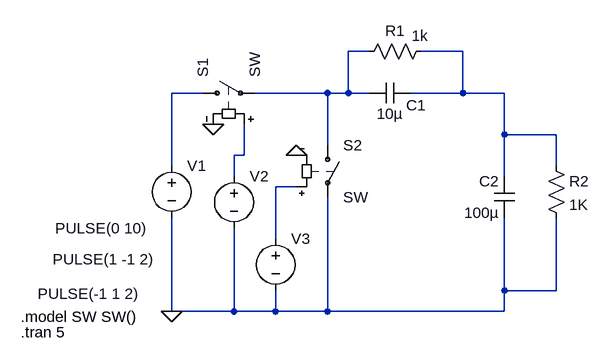
[diagram p0: schematic CA lab 1[1202].asc]
CA lab 1[1202].asc, the LTspice schematic file:
Version 4
SHEET 1 880 680
WIRE 272 -32 240 -32
WIRE 416 -32 352 -32
WIRE 16 32 -32 32
WIRE 208 32 96 32
WIRE 240 32 240 -32
WIRE 240 32 208 32
WIRE 272 32 240 32
WIRE 416 32 416 -32
WIRE 416 32 336 32
WIRE 480 32 416 32
WIRE 480 96 480 32
WIRE 560 96 480 96
WIRE 208 112 208 32
WIRE 80 128 80 80
WIRE 80 128 64 128
WIRE -32 144 -32 32
WIRE 560 144 560 96
WIRE 64 160 64 128
WIRE 480 160 480 96
WIRE 160 176 128 176
WIRE 128 256 128 176
WIRE 480 336 480 224
WIRE 560 336 560 224
WIRE 560 336 480 336
WIRE -32 368 -32 224
WIRE 64 368 64 240
WIRE 64 368 -32 368
WIRE 128 368 128 336
WIRE 128 368 64 368
WIRE 208 368 208 192
WIRE 208 368 128 368
WIRE 480 368 480 336
WIRE 480 368 208 368
FLAG -32 368 0
FLAG 160 128 0
FLAG 32 80 0
SYMBOL voltage -32 128 R0
WINDOW 3 -179 112 Left 2
WINDOW 123 0 0 Left 2
WINDOW 39 0 0 Left 2
SYMATTR Value PULSE(0 10)
SYMATTR InstName V1
SYMBOL cap 336 16 R90
WINDOW 0 50 -8 VBottom 2
WINDOW 3 32 32 VTop 2
SYMATTR InstName C1
SYMATTR Value 10µ
SYMBOL cap 496 224 R180
WINDOW 0 24 56 Left 2
WINDOW 3 24 8 Left 2
SYMATTR InstName C2
SYMATTR Value 100µ
SYMBOL res 256 -16 R270
WINDOW 0 32 56 VTop 2
WINDOW 3 56 94 VBottom 2
SYMATTR InstName R1
SYMATTR Value 1k
SYMBOL res 544 128 R0
SYMATTR InstName R2
SYMATTR Value 1K
SYMBOL sw 0 32 R270
SYMATTR InstName S1
SYMBOL sw 208 96 R0
SYMATTR InstName S2
SYMBOL voltage 64 144 R0
WINDOW 3 -279 144 Left 2
WINDOW 123 0 0 Left 2
WINDOW 39 0 0 Left 2
SYMATTR Value PULSE(1 -1 2)
SYMATTR InstName V2
SYMBOL voltage 128 240 R0
WINDOW 3 -366 101 Left 2
WINDOW 123 0 0 Left 2
WINDOW 39 0 0 Left 2
SYMATTR Value PULSE(-1 1 2)
SYMATTR InstName V3
TEXT -264 376 Left 2 !.model SW SW()
TEXT -264 400 Left 2 !.tran 5

The netlist it stands for:
* CA lab 1[1202].asc
V1 N003 0 PULSE(0 10)
C1 N002 N001 10µ
C2 0 N002 100µ
R1 N001 N002 1k
R2 N002 0 1K
S1 N003 N001 N004 0 SW
S2 N001 0 N005 0 SW
V2 N004 0 PULSE(1 -1 2)
V3 N005 0 PULSE(-1 1 2)
.model SW SW()
.tran 5
.backanno
.end